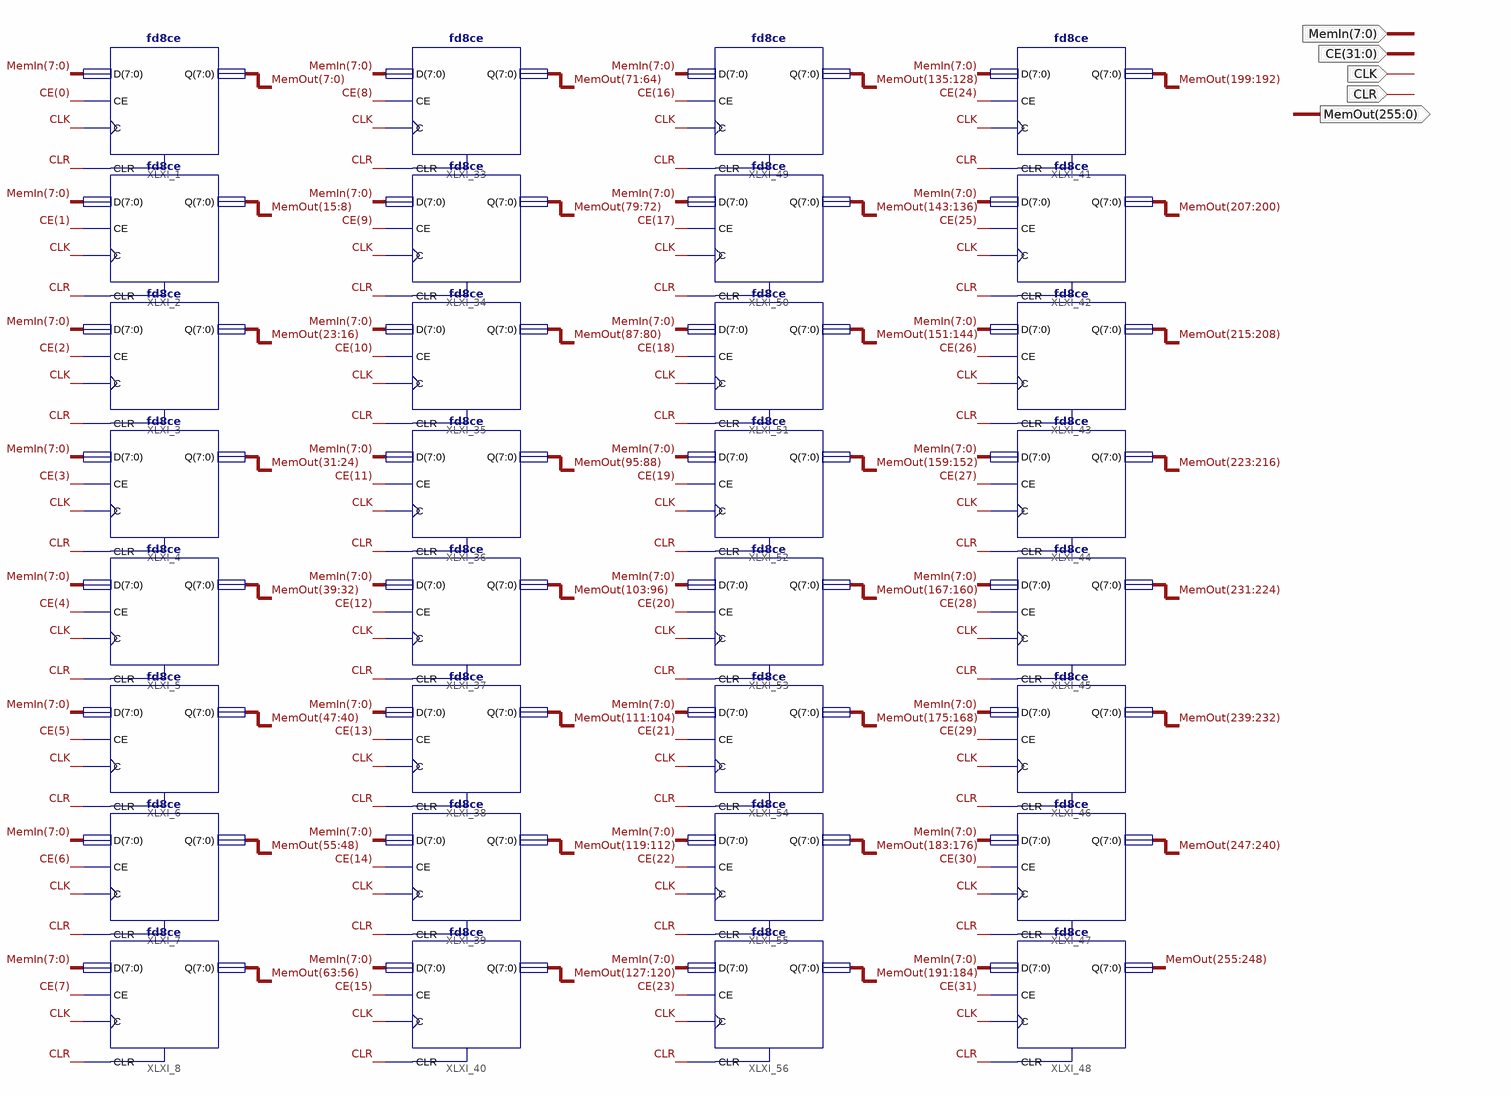
[diagram p0: schematic sheet 1]
// Xilinx ISE schematic Mem32xBank.sch (spartan3e) as structural Verilog: 32 symbols, 5 ports
module Mem32xBank (
  input  [31:0] CE,
  input  CLK,
  input  CLR,
  input  [7:0] MemIn,
  output [255:0] MemOut
);

  fd8ce XLXI_1 (.C(CLK), .CE(CE[0]), .CLR(CLR), .D(MemIn), .Q(MemOut[7:0]));
  fd8ce XLXI_2 (.C(CLK), .CE(CE[1]), .CLR(CLR), .D(MemIn), .Q(MemOut[15:8]));
  fd8ce XLXI_3 (.C(CLK), .CE(CE[2]), .CLR(CLR), .D(MemIn), .Q(MemOut[23:16]));
  fd8ce XLXI_4 (.C(CLK), .CE(CE[3]), .CLR(CLR), .D(MemIn), .Q(MemOut[31:24]));
  fd8ce XLXI_5 (.C(CLK), .CE(CE[4]), .CLR(CLR), .D(MemIn), .Q(MemOut[39:32]));
  fd8ce XLXI_6 (.C(CLK), .CE(CE[5]), .CLR(CLR), .D(MemIn), .Q(MemOut[47:40]));
  fd8ce XLXI_7 (.C(CLK), .CE(CE[6]), .CLR(CLR), .D(MemIn), .Q(MemOut[55:48]));
  fd8ce XLXI_8 (.C(CLK), .CE(CE[7]), .CLR(CLR), .D(MemIn), .Q(MemOut[63:56]));
  fd8ce XLXI_41 (.C(CLK), .CE(CE[24]), .CLR(CLR), .D(MemIn), .Q(MemOut[199:192]));
  fd8ce XLXI_49 (.C(CLK), .CE(CE[16]), .CLR(CLR), .D(MemIn), .Q(MemOut[135:128]));
  fd8ce XLXI_33 (.C(CLK), .CE(CE[8]), .CLR(CLR), .D(MemIn), .Q(MemOut[71:64]));
  fd8ce XLXI_48 (.C(CLK), .CE(CE[31]), .CLR(CLR), .D(MemIn), .Q(MemOut[255:248]));
  fd8ce XLXI_47 (.C(CLK), .CE(CE[30]), .CLR(CLR), .D(MemIn), .Q(MemOut[247:240]));
  fd8ce XLXI_46 (.C(CLK), .CE(CE[29]), .CLR(CLR), .D(MemIn), .Q(MemOut[239:232]));
  fd8ce XLXI_45 (.C(CLK), .CE(CE[28]), .CLR(CLR), .D(MemIn), .Q(MemOut[231:224]));
  fd8ce XLXI_44 (.C(CLK), .CE(CE[27]), .CLR(CLR), .D(MemIn), .Q(MemOut[223:216]));
  fd8ce XLXI_43 (.C(CLK), .CE(CE[26]), .CLR(CLR), .D(MemIn), .Q(MemOut[215:208]));
  fd8ce XLXI_42 (.C(CLK), .CE(CE[25]), .CLR(CLR), .D(MemIn), .Q(MemOut[207:200]));
  fd8ce XLXI_56 (.C(CLK), .CE(CE[23]), .CLR(CLR), .D(MemIn), .Q(MemOut[191:184]));
  fd8ce XLXI_55 (.C(CLK), .CE(CE[22]), .CLR(CLR), .D(MemIn), .Q(MemOut[183:176]));
  fd8ce XLXI_54 (.C(CLK), .CE(CE[21]), .CLR(CLR), .D(MemIn), .Q(MemOut[175:168]));
  fd8ce XLXI_53 (.C(CLK), .CE(CE[20]), .CLR(CLR), .D(MemIn), .Q(MemOut[167:160]));
  fd8ce XLXI_52 (.C(CLK), .CE(CE[19]), .CLR(CLR), .D(MemIn), .Q(MemOut[159:152]));
  fd8ce XLXI_51 (.C(CLK), .CE(CE[18]), .CLR(CLR), .D(MemIn), .Q(MemOut[151:144]));
  fd8ce XLXI_50 (.C(CLK), .CE(CE[17]), .CLR(CLR), .D(MemIn), .Q(MemOut[143:136]));
  fd8ce XLXI_40 (.C(CLK), .CE(CE[15]), .CLR(CLR), .D(MemIn), .Q(MemOut[127:120]));
  fd8ce XLXI_39 (.C(CLK), .CE(CE[14]), .CLR(CLR), .D(MemIn), .Q(MemOut[119:112]));
  fd8ce XLXI_38 (.C(CLK), .CE(CE[13]), .CLR(CLR), .D(MemIn), .Q(MemOut[111:104]));
  fd8ce XLXI_37 (.C(CLK), .CE(CE[12]), .CLR(CLR), .D(MemIn), .Q(MemOut[103:96]));
  fd8ce XLXI_36 (.C(CLK), .CE(CE[11]), .CLR(CLR), .D(MemIn), .Q(MemOut[95:88]));
  fd8ce XLXI_35 (.C(CLK), .CE(CE[10]), .CLR(CLR), .D(MemIn), .Q(MemOut[87:80]));
  fd8ce XLXI_34 (.C(CLK), .CE(CE[9]), .CLR(CLR), .D(MemIn), .Q(MemOut[79:72]));
endmodule
